# EAGLE design drutest2 (EAGLE 6.0)
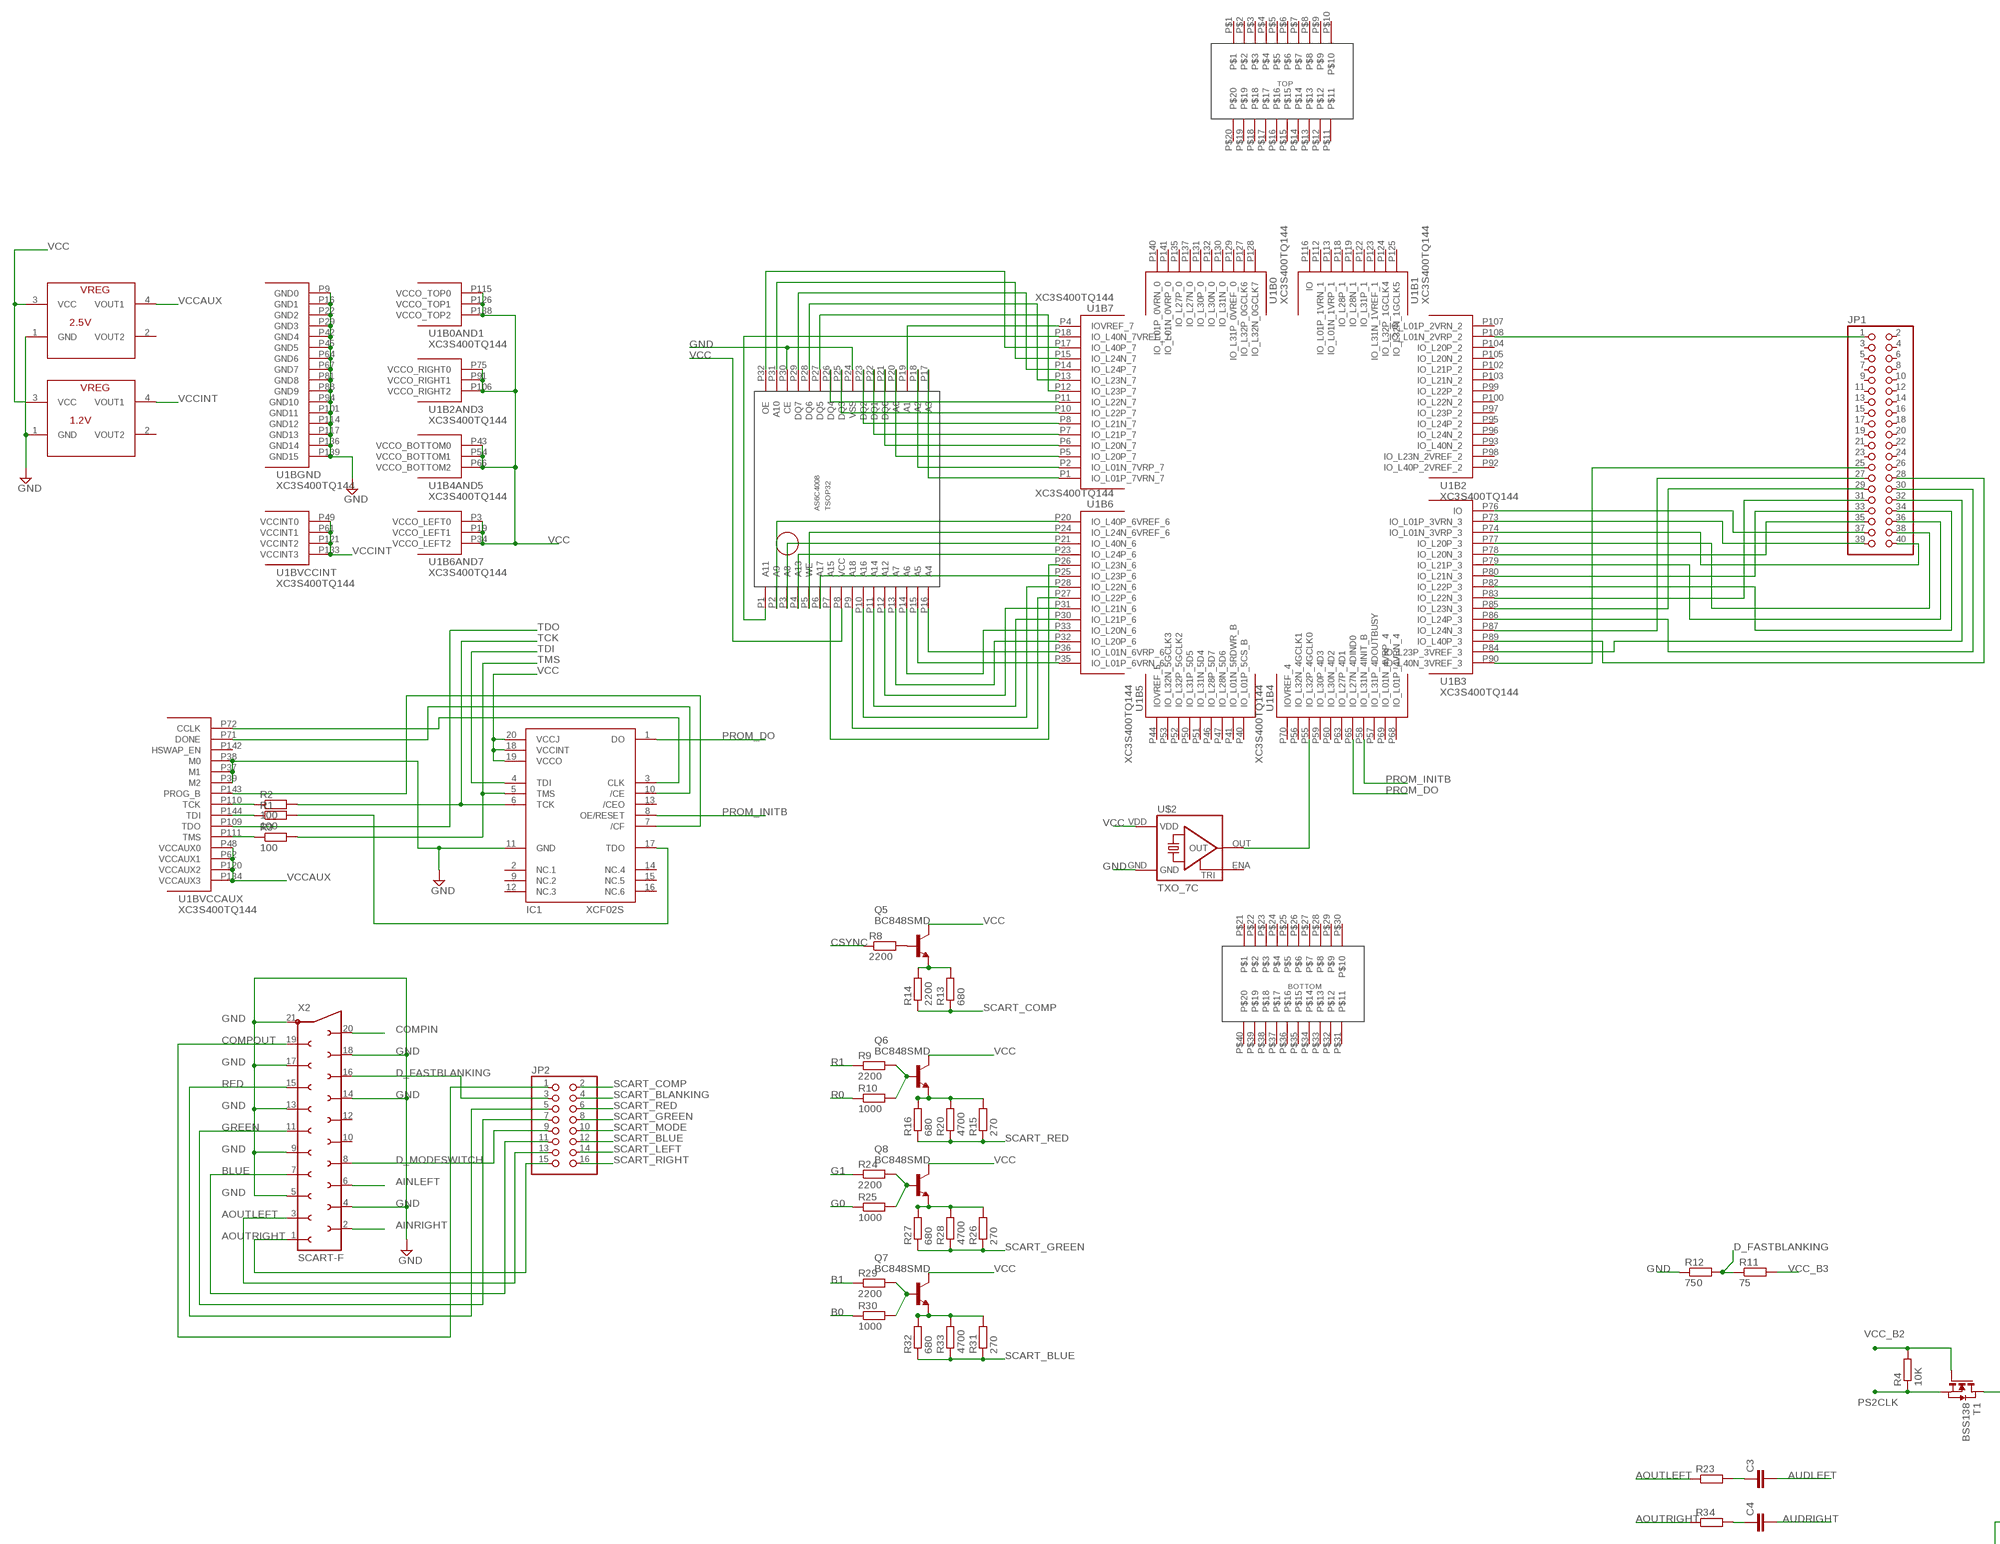
[diagram p0: schematic, sheet 1, part 1 of 2]
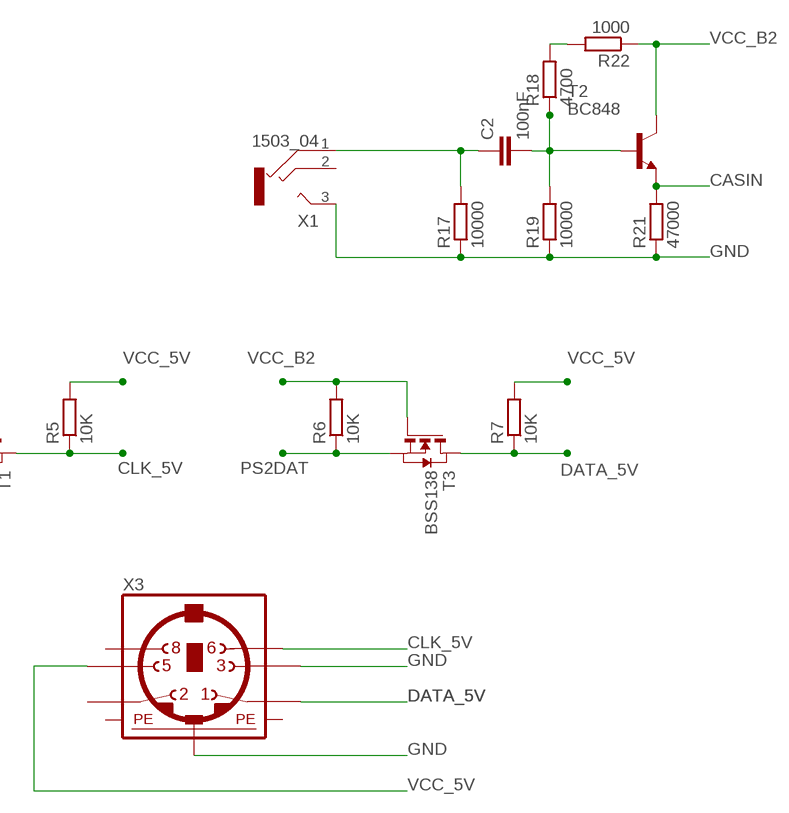
[diagram p1: schematic, sheet 1, part 2 of 2]

## Parts
C2  100nF  C-EUC0603  [C0603]
C3  C-EUC0603  [C0603]
C4  C-EUC0603  [C0603]
IC1  XCF02S  [VO20]
JP1  PINHD-2X20  [2X20]
JP2  PINHD-2X8  [2X08]
Q5  BC848SMD  [SOT23]
Q6  BC848SMD  [SOT23]
Q7  BC848SMD  [SOT23]
Q8  BC848SMD  [SOT23]
R1  100  R-EU_R0805  [R0805]
R2  100  R-EU_R0805  [R0805]
R3  100  R-EU_R0805  [R0805]
R4  10K  R-EU_R0805  [R0805]
R5  10K  R-EU_R0805  [R0805]
R6  10K  R-EU_R0805  [R0805]
R7  10K  R-EU_R0805  [R0805]
R8  2200  R-EU_R0805  [R0805]
R9  2200  R-EU_R0805  [R0805]
R10  1000  R-EU_R0805  [R0805]
R11  75  R-EU_R0805  [R0805]
R12  750  R-EU_R0805  [R0805]
R13  680  R-EU_R0805  [R0805]
R14  2200  R-EU_R0805  [R0805]
R15  270  R-EU_R0805  [R0805]
R16  680  R-EU_R0805  [R0805]
R17  10000  R-EU_R0805  [R0805]
R18  4700  R-EU_R0805  [R0805]
R19  10000  R-EU_R0805  [R0805]
R20  4700  R-EU_R0805  [R0805]
R21  47000  R-EU_R0805  [R0805]
R22  1000  R-EU_R0805  [R0805]
R23  R-EU_M0805  [M0805]
R24  2200  R-EU_R0805  [R0805]
R25  1000  R-EU_R0805  [R0805]
R26  270  R-EU_R0805  [R0805]
R27  680  R-EU_R0805  [R0805]
R28  4700  R-EU_R0805  [R0805]
R29  2200  R-EU_R0805  [R0805]
R30  1000  R-EU_R0805  [R0805]
R31  270  R-EU_R0805  [R0805]
R32  680  R-EU_R0805  [R0805]
R33  4700  R-EU_R0805  [R0805]
R34  R-EU_M0805  [M0805]
T1  BSS138  NMOSSOT23  [SOT-23]
T2  BC848  [SOT23]
T3  BSS138  NMOSSOT23  [SOT-23]
U1  XC3S400TQ144  [TQ144]
U$1  AS6C4008  [TSOP32]
U$2  TXO_7C  [OSC_7C]
U$3  2.5V  NX1117  [SOT223]
U$4  1.2V  NX1117  [SOT223]
U$5  EXPHDR  [EXPHDR]
X1  1503_04  [1503_04]
X2  SCART-F  [SCART-F]
X3  MINI_DIN_6  [M_DIN6]

## Nets
AINLEFT: X2.6
AINRIGHT: X2.2
AOUTLEFT: JP2.13 R23.1 X2.3
AOUTRIGHT: JP2.15 R34.1 X2.1
AUDLEFT: C3.2
AUDRIGHT: C4.2
B0: R30.1
B1: R29.1
BLUE: JP2.11 X2.7
CASIN: R21.2 T2.2(E)
CLK_5V: R5.1 T1.1(D) X3.6
COMPIN: X2.20
COMPOUT: JP2.1 X2.19
CSYNC: R8.1
D_FASTBLANKING: JP2.3 R11.1 R12.2 X2.16
D_MODESWITCH: JP2.9 X2.8
DATA_5V: R7.1 T3.1(D) X3.1
G0: R25.1
G1: R24.1
GND: IC1.11(GND) R12.1 R17.1 R19.1 R21.1 U1.P9(BGND:GND0) U1.P16(BGND:GND1) U1.P22(BGND:GND2) U1.P29(BGND:GND3) U1.P37(BVCCAUX:M1) U1.P38(BVCCAUX:M0) U1.P39(BVCCAUX:M2) U1.P42(BGND:GND4) U1.P45(BGND:GND5) U1.P64(BGND:GND6) U1.P67(BGND:GND7) U1.P81(BGND:GND8) U1.P88(BGND:GND9) U1.P94(BGND:GND10) U1.P101(BGND:GND11) U1.P114(BGND:GND12) U1.P117(BGND:GND13) U1.P136(BGND:GND14) U1.P139(BGND:GND15) U$1.P24(VSS) U$1.P30(CE) U$2.GND U$3.1(GND) U$4.1(GND) X1.3 X2.4 X2.5 X2.9 X2.13 X2.14 X2.17 X2.18 X2.21 X3.3 X3.SH2(PE2)
GREEN: JP2.7 X2.11
N$1: U1.P1(B7:IO_L01P_7VRN_7) U$1.P17(A3)
N$2: U1.P2(B7:IO_L01N_7VRP_7) U$1.P18(A2)
N$3: U1.P4(B7:IOVREF_7) U$1.P19(A1)
N$4: U1.P5(B7:IO_L20P_7) U$1.P20(A0)
N$5: U1.P6(B7:IO_L20N_7) U$1.P21(DQ0)
N$6: U1.P7(B7:IO_L21P_7) U$1.P22(DQ1)
N$7: U1.P8(B7:IO_L21N_7) U$1.P23(DQ2)
N$8: U1.P10(B7:IO_L22P_7) U$1.P25(DQ3)
N$9: U1.P11(B7:IO_L22N_7) U$1.P26(DQ4)
N$10: U1.P12(B7:IO_L23P_7) U$1.P27(DQ5)
N$11: U1.P13(B7:IO_L23N_7) U$1.P28(DQ6)
N$12: U1.P14(B7:IO_L24P_7) U$1.P29(DQ7)
N$13: U1.P15(B7:IO_L24N_7) U$1.P31(A10)
N$14: U1.P17(B7:IO_L40P_7) U$1.P32(OE)
N$15: U1.P18(B7:IO_L40N_7VREF_7) U$1.P1(A11)
N$16: U1.P20(B6:IO_L40P_6VREF_6) U$1.P2(A9)
N$17: U1.P21(B6:IO_L40N_6) U$1.P3(A8)
N$18: U1.P23(B6:IO_L24P_6) U$1.P4(A13)
N$19: U1.P24(B6:IO_L24N_6VREF_6) U$1.P5(WE)
N$20: U1.P25(B6:IO_L23P_6) U$1.P6(A17)
N$21: U1.P26(B6:IO_L23N_6) U$1.P7(A15)
N$22: U1.P27(B6:IO_L22P_6) U$1.P9(A18)
N$23: U1.P28(B6:IO_L22N_6) U$1.P10(A16)
N$24: U1.P30(B6:IO_L21P_6) U$1.P11(A14)
N$25: U1.P31(B6:IO_L21N_6) U$1.P12(A12)
N$26: U1.P32(B6:IO_L20P_6) U$1.P13(A7)
N$27: U1.P33(B6:IO_L20N_6) U$1.P14(A6)
N$28: U1.P35(B6:IO_L01P_6VRN_6) U$1.P15(A5)
N$29: U1.P36(B6:IO_L01N_6VRP_6) U$1.P16(A4)
N$30: JP1.1 U1.P108(B2:IO_L01N_2VRP_2)
N$31: JP1.39 U1.P73(B3:IO_L01P_3VRN_3)
N$32: JP1.40 U1.P74(B3:IO_L01N_3VRP_3)
N$33: JP1.37 U1.P76(B3:IO)
N$34: JP1.38 U1.P77(B3:IO_L20P_3)
N$35: IC1.3(CLK) U1.P72(BVCCAUX:CCLK)
N$36: IC1.17(TDO) R1.2
N$37: JP1.35 U1.P78(B3:IO_L20N_3)
N$38: IC1.10(/CE) U1.P71(BVCCAUX:DONE)
N$39: R2.1 U1.P110(BVCCAUX:TCK)
N$40: IC1.7(/CF) U1.P143(BVCCAUX:PROG_B)
N$41: JP1.36 U1.P79(B3:IO_L21P_3)
N$42: R1.1 U1.P144(BVCCAUX:TDI)
N$43: R3.1 U1.P111(BVCCAUX:TMS)
N$44: JP1.33 U1.P80(B3:IO_L21N_3)
N$45: JP1.34 U1.P82(B3:IO_L22P_3)
N$46: JP1.31 U1.P83(B3:IO_L22N_3)
N$47: JP1.32 U1.P84(B3:IO_L23P_3VREF_3)
N$48: JP1.29 U1.P85(B3:IO_L23N_3)
N$49: JP1.30 U1.P86(B3:IO_L24P_3)
N$50: JP1.27 U1.P87(B3:IO_L24N_3)
N$51: JP1.28 U1.P89(B3:IO_L40P_3)
N$52: JP1.25 U1.P90(B3:IO_L40N_3VREF_3)
N$53: Q6.1(B) R9.2 R10.2
N$54: Q6.2(E) R15.2 R16.2 R20.2
N$55: Q8.1(B) R24.2 R25.2
N$56: Q8.2(E) R26.2 R27.2 R28.2
N$57: Q7.1(B) R29.2 R30.2
N$58: Q7.2(E) R31.2 R32.2 R33.2
N$59: Q5.2(E) R13.2 R14.2
N$60: C2.2 R18.1 R19.2 T2.1(B)
N$61: C2.1 R17.2 X1.1
N$62: R18.2 R22.2
N$63: Q5.1(B) R8.2
N$64: C3.1 R23.2
N$65: C4.1 R34.2
N$66: U1.P55(B4:IO_L32P_4GCLK0) U$2.OUT
PROM_DO: IC1.1(DO) U1.P65(B4:IO_L27N_4DIND0)
PROM_INITB: IC1.8(OE/RESET) U1.P58(B4:IO_L31N_4INIT_B)
PS2CLK: R4.1 T1.2(S)
PS2DAT: R6.1 T3.2(S)
R0: R10.1
R1: R9.1
RED: JP2.5 X2.15
SCART_BLANKING: JP2.4
SCART_BLUE: JP2.12 R31.1 R32.1 R33.1
SCART_COMP: JP2.2 R13.1 R14.1
SCART_GREEN: JP2.8 R26.1 R27.1 R28.1
SCART_LEFT: JP2.14
SCART_MODE: JP2.10
SCART_RED: JP2.6 R15.1 R16.1 R20.1
SCART_RIGHT: JP2.16
TCK: IC1.6(TCK) R2.2
TDI: IC1.4(TDI)
TDO: U1.P109(BVCCAUX:TDO)
TMS: IC1.5(TMS) R3.2
VCC: IC1.18(VCCINT) IC1.19(VCCO) IC1.20(VCCJ) Q5.3(C) Q6.3(C) Q7.3(C) Q8.3(C) U1.P3(B6AND7:VCCO_LEFT0) U1.P19(B6AND7:VCCO_LEFT1) U1.P34(B6AND7:VCCO_LEFT2) U1.P43(B4AND5:VCCO_BOTTOM0) U1.P54(B4AND5:VCCO_BOTTOM1) U1.P66(B4AND5:VCCO_BOTTOM2) U1.P75(B2AND3:VCCO_RIGHT0) U1.P91(B2AND3:VCCO_RIGHT1) U1.P106(B2AND3:VCCO_RIGHT2) U1.P115(B0AND1:VCCO_TOP0) U1.P126(B0AND1:VCCO_TOP1) U1.P138(B0AND1:VCCO_TOP2) U$1.P8(VCC) U$2.VDD U$3.3(VCC) U$4.3(VCC)
VCC_5V [power]: R5.2 R7.2 X3.5
VCC_B2: R4.2 R6.2 R22.1 T1.3(G) T2.3(C) T3.3(G)
VCC_B3: R11.2
VCCAUX: U1.P48(BVCCAUX:VCCAUX0) U1.P62(BVCCAUX:VCCAUX1) U1.P120(BVCCAUX:VCCAUX2) U1.P134(BVCCAUX:VCCAUX3) U$3.4(VOUT1)
VCCINT: U1.P49(BVCCINT:VCCINT0) U1.P61(BVCCINT:VCCINT1) U1.P121(BVCCINT:VCCINT2) U1.P133(BVCCINT:VCCINT3) U$4.4(VOUT1)
Unconnected: IC1.2(NC.1) IC1.9(NC.2) IC1.12(NC.3) IC1.13(/CEO) IC1.14(NC.4) IC1.15(NC.5) IC1.16(NC.6) JP1.2 JP1.3 JP1.4 JP1.5 JP1.6 JP1.7 JP1.8 JP1.9 JP1.10 JP1.11 JP1.12 JP1.13 JP1.14 JP1.15 JP1.16 JP1.17 JP1.18 JP1.19 JP1.20 JP1.21 JP1.22 JP1.23 JP1.24 JP1.26 U1.P40(B5:IO_L01P_5CS_B) U1.P41(B5:IO_L01N_5RDWR_B) U1.P44(B5:IOVREF_5) U1.P46(B5:IO_L28P_5D7) U1.P47(B5:IO_L28N_5D6) U1.P50(B5:IO_L31P_5D5) U1.P51(B5:IO_L31N_5D4) U1.P52(B5:IO_L32P_5GCLK2) U1.P53(B5:IO_L32N_5GCLK3) U1.P56(B4:IO_L32N_4GCLK1) U1.P57(B4:IO_L31P_4DOUTBUSY) U1.P59(B4:IO_L30P_4D3) U1.P60(B4:IO_L30N_4D2) U1.P63(B4:IO_L27P_4D1) U1.P68(B4:IO_L01P_4VRN_4) U1.P69(B4:IO_L01N_4VRP_4) U1.P70(B4:IOVREF_4) U1.P92(B2:IO_L40P_2VREF_2) U1.P93(B2:IO_L40N_2) U1.P95(B2:IO_L24P_2) U1.P96(B2:IO_L24N_2) U1.P97(B2:IO_L23P_2) U1.P98(B2:IO_L23N_2VREF_2) U1.P99(B2:IO_L22P_2) U1.P100(B2:IO_L22N_2) U1.P102(B2:IO_L21P_2) U1.P103(B2:IO_L21N_2) U1.P104(B2:IO_L20P_2) U1.P105(B2:IO_L20N_2) U1.P107(B2:IO_L01P_2VRN_2) U1.P112(B1:IO_L01P_1VRN_1) U1.P113(B1:IO_L01N_1VRP_1) U1.P116(B1:IO) U1.P118(B1:IO_L28P_1) U1.P119(B1:IO_L28N_1) U1.P122(B1:IO_L31P_1) U1.P123(B1:IO_L31N_1VREF_1) U1.P124(B1:IO_L32P_1GCLK4) U1.P125(B1:IO_L32N_1GCLK5) U1.P127(B0:IO_L32P_0GCLK6) U1.P128(B0:IO_L32N_0GCLK7) U1.P129(B0:IO_L31P_0VREF_0) U1.P130(B0:IO_L31N_0) U1.P131(B0:IO_L30P_0) U1.P132(B0:IO_L30N_0) U1.P135(B0:IO_L27P_0) U1.P137(B0:IO_L27N_0) U1.P140(B0:IO_L01P_0VRN_0) U1.P141(B0:IO_L01N_0VRP_0) U1.P142(BVCCAUX:HSWAP_EN) U$2.ENA(TRI) U$3.2(VOUT2) U$4.2(VOUT2) U$5.P$1 U$5.P$2 U$5.P$3 U$5.P$4 U$5.P$5 U$5.P$6 U$5.P$7 U$5.P$8 U$5.P$9 U$5.P$10 U$5.P$11 U$5.P$12 U$5.P$13 U$5.P$14 U$5.P$15 U$5.P$16 U$5.P$17 U$5.P$18 U$5.P$19 U$5.P$20 U$5.P$21 U$5.P$22 U$5.P$23 U$5.P$24 U$5.P$25 U$5.P$26 U$5.P$27 U$5.P$28 U$5.P$29 U$5.P$30 U$5.P$31 U$5.P$32 U$5.P$33 U$5.P$34 U$5.P$35 U$5.P$36 U$5.P$37 U$5.P$38 U$5.P$39 U$5.P$40 X1.2 X2.10 X2.12 X3.2 X3.8

## Power pins joined to a net without a drawn wire
PE1: X3.SH1(PE1)
PE3: X3.SH3(PE3)

## Library data of the parts
C2-C4 = resistor:C-EU: CAPACITOR, European symbol
IC1 = smd-special:XCF02S
JP1 = pinhead:PINHD-2X20: PIN HEADER
JP2 = pinhead:PINHD-2X8: PIN HEADER
Q5-Q8 = bc548:BC848*: NPN Transistor
R1-R22 R24-R33 = rcl:R-EU_: RESISTOR, European symbol
R23 R34 = resistor:R-EU_: RESISTOR, European symbol
T1 T3 = zetex:NMOSSOT23: MOS FET; OC_FARNELL: unknown; OC_NEWARK: unknown
T2 = transistor:BC848: NPN TRANSISTOR
U1 = xilinx_spartan3_virtex4_and_5:XC3S400TQ144: Xilinx FPGA
U$1 = cpcfpga:AS6C4008
U$2 = cpcfpga:TXO_7C: TXC crystal oscillator http://www.txccrystal.com/images/pdf/7c.pdf
U$3 U$4 = cpcfpga:NX1117
U$5 = cpcfpga:EXPHDR
X1 = con-lumberg:1503_04: Jack connectors according to JISC 6560, 3.5 mm, IP 57 Klinkensteckverbinder nach JISC 6560, 3,5 mm, IP 57 Source: http://www.lumberg.com/Produkte/PDFs/1503_04.pdf; OC_FARNELL: 1216981; OC_NEWARK: unknown
X2 = con-hirschmann:SCART-F: TV SCART CONNECTOR; OC_FARNELL: unknown; OC_NEWARK: unknown
X3 = mini_din:MINI_DIN_6

## Net classes
1 power: width 0.6 mm, drill 1.1 mm, clearance 0.4 mm

## Board
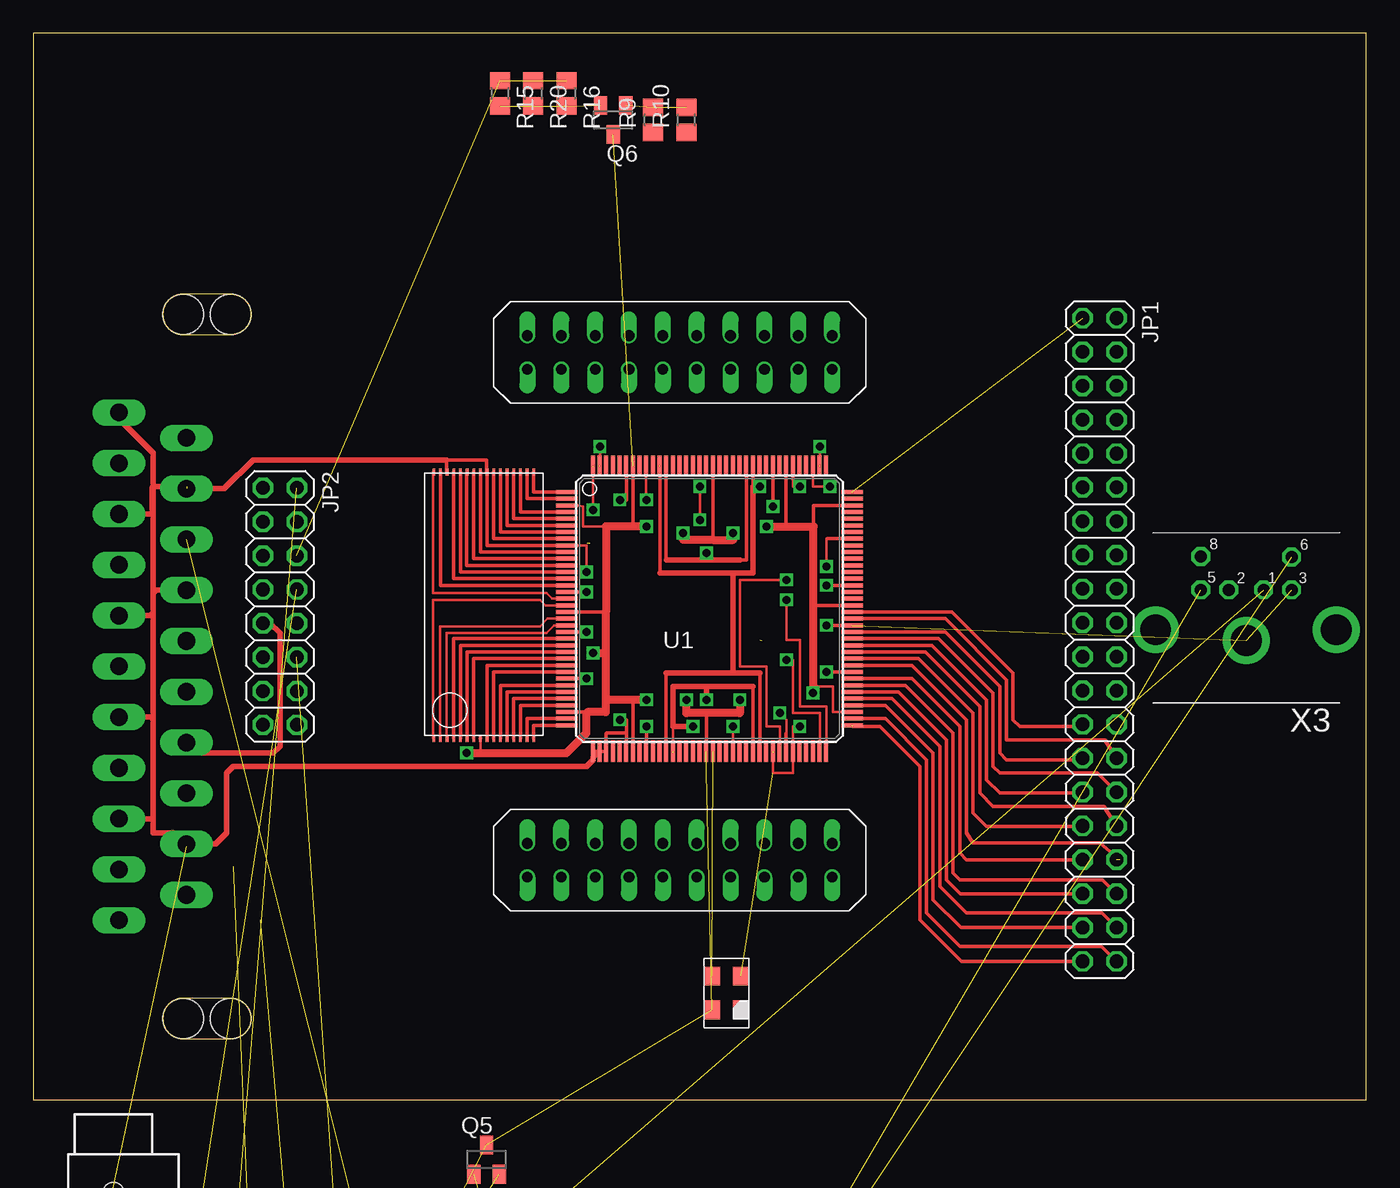
[diagram p2: board, top side]
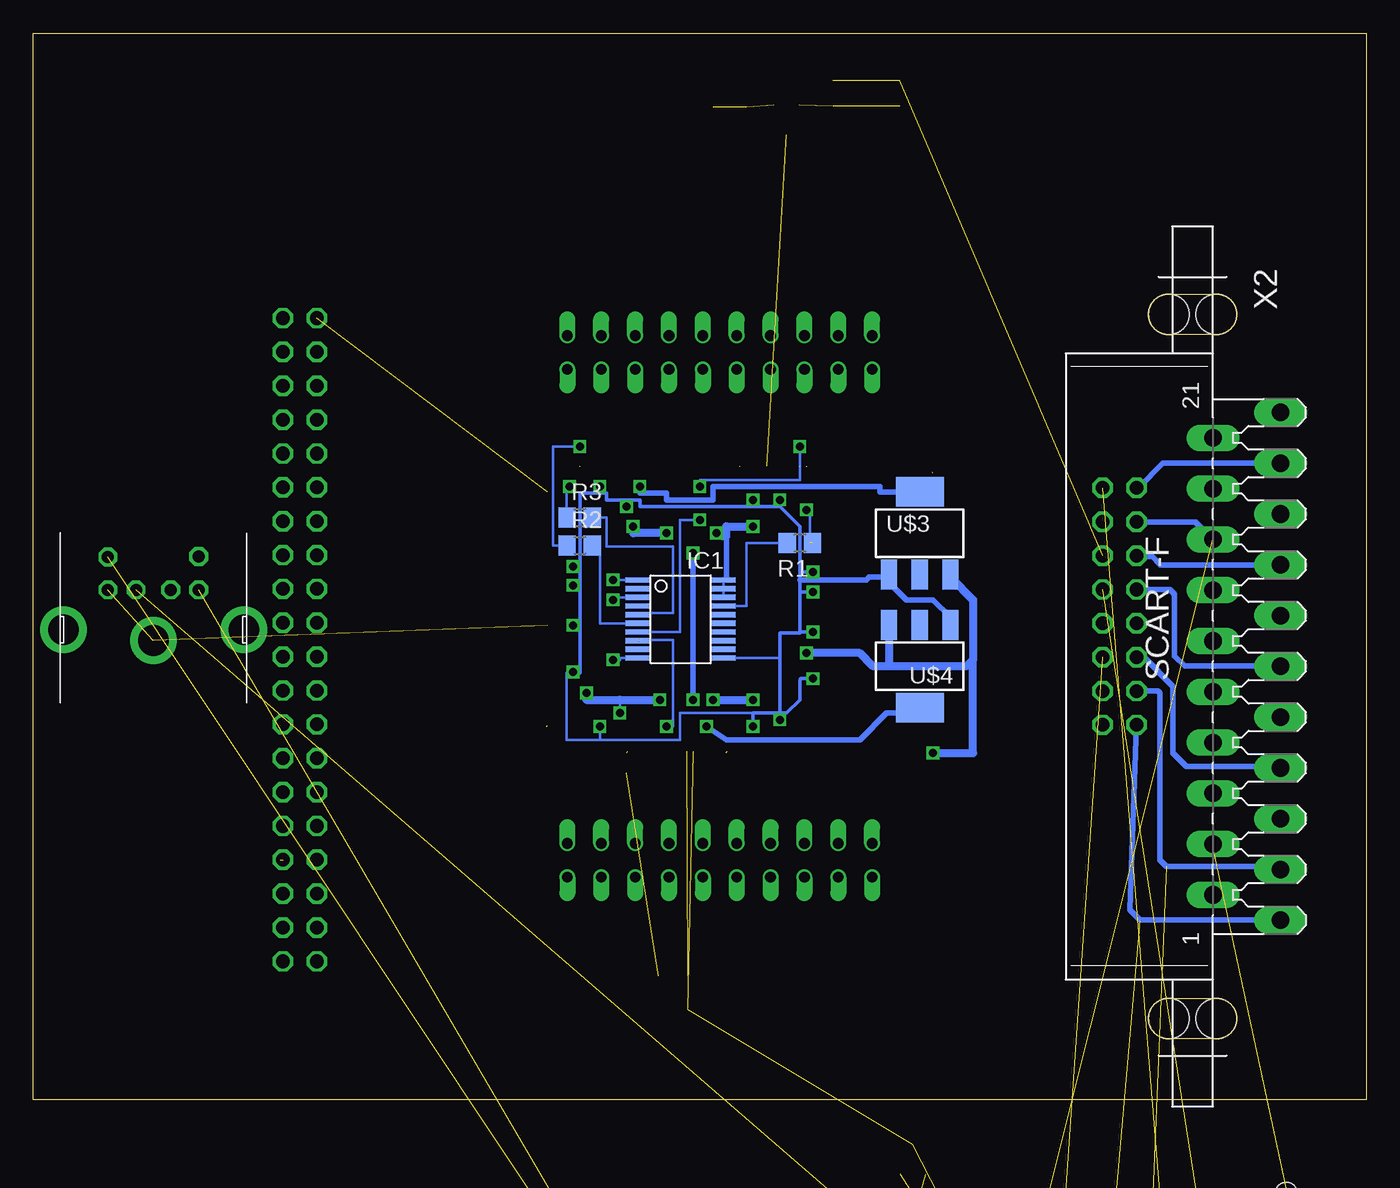
[diagram p3: board, bottom side, seen from below]

Size 100 x 80 mm. Coordinates in mm from the lower left corner, seen from the top.
Outline: 0,0 100,0 100,80 0,80 0,0
Copper layers (1*16): Top 0.0356mm / dielectric 1.5011mm / Bottom 0.0356mm
Design rules: minimum track width 6mil, minimum drill 13mil, track to track 6mil, track to pad 6mil, pad to pad 6mil, via to via 6mil, smd to smd 6mil, copper to edge 15mil, drill to drill 6mil, minimum pad ring 7mil, minimum via ring 7mil, stop-mask expansion 4mil, vias tented up to drill 0mil, thermal gap 10mil

### Footprints (pad centres in the part's own frame; a part is rotated, then mirrored left to right if it is on the bottom)
C0603 = smd 1.1 x 1: 1 -0.85,0; 2 0.85,0
VO20 = smd 0.4 x 1.8: 1 5.85,6.15; 2 5.2,6.15; 3 4.55,6.15; 4 3.9,6.15; 5 3.25,6.15; 6 2.6,6.15; 7 1.95,6.15; 8 1.3,6.15; 9 0.65,6.15; 10 0,6.15; 11 0,-0.3; 12 0.65,-0.3; 13 1.3,-0.3; 14 1.95,-0.3; 15 2.6,-0.3; 16 3.25,-0.3; 17 3.9,-0.3; 18 4.55,-0.3; 19 5.2,-0.3; 20 5.85,-0.3
2X20 = drill 1.016 octagon: 1 -24.13,-1.27; 2 -24.13,1.27; 3 -21.59,-1.27; 4 -21.59,1.27; 5 -19.05,-1.27; 6 -19.05,1.27; 7 -16.51,-1.27; 8 -16.51,1.27; 9 -13.97,-1.27; 10 -13.97,1.27; 11 -11.43,-1.27; 12 -11.43,1.27; 13 -8.89,-1.27; 14 -8.89,1.27; 15 -6.35,-1.27; 16 -6.35,1.27; 17 -3.81,-1.27; 18 -3.81,1.27; 19 -1.27,-1.27; 20 -1.27,1.27; 21 1.27,-1.27; 22 1.27,1.27; 23 3.81,-1.27; 24 3.81,1.27; 25 6.35,-1.27; 26 6.35,1.27; 27 8.89,-1.27; 28 8.89,1.27; 29 11.43,-1.27; 30 11.43,1.27; 31 13.97,-1.27; 32 13.97,1.27; 33 16.51,-1.27; 34 16.51,1.27; 35 19.05,-1.27; 36 19.05,1.27; 37 21.59,-1.27; 38 21.59,1.27; 39 24.13,-1.27; 40 24.13,1.27
2X08 = drill 1.016 octagon: 1 -8.89,-1.27; 2 -8.89,1.27; 3 -6.35,-1.27; 4 -6.35,1.27; 5 -3.81,-1.27; 6 -3.81,1.27; 7 -1.27,-1.27; 8 -1.27,1.27; 9 1.27,-1.27; 10 1.27,1.27; 11 3.81,-1.27; 12 3.81,1.27; 13 6.35,-1.27; 14 6.35,1.27; 15 8.89,-1.27; 16 8.89,1.27
SOT23 = smd 1 x 1.4: 1 -0.95,-1.1; 2 0.95,-1.1; 3 0,1.1
R0805 = smd 1.3 x 1.5: 1 -0.95,0; 2 0.95,0
M0805 = smd 1.3 x 1.6: 1 -0.95,0; 2 0.95,0
SOT-23 = smd 0.787 x 0.889: 1 0.025,-1.016; 2 -0.94,1.016; 3 0.991,1.016
TQ144 = smd 1.6 x 0.3: P1 -10.7,8.75; P2 -10.7,8.25; P3 -10.7,7.75; P4 -10.7,7.25; P5 -10.7,6.75; P6 -10.7,6.25; P7 -10.7,5.75; P8 -10.7,5.25; P9 -10.7,4.75; P10 -10.7,4.25; P11 -10.7,3.75; P12 -10.7,3.25; P13 -10.7,2.75; P14 -10.7,2.25; P15 -10.7,1.75; P16 -10.7,1.25; P17 -10.7,0.75; P18 -10.7,0.25; P19 -10.7,-0.25; P20 -10.7,-0.75; P21 -10.7,-1.25; P22 -10.7,-1.75; P23 -10.7,-2.25; P24 -10.7,-2.75; P25 -10.7,-3.25; P26 -10.7,-3.75; P27 -10.7,-4.25; P28 -10.7,-4.75; P29 -10.7,-5.25; P30 -10.7,-5.75; P31 -10.7,-6.25; P32 -10.7,-6.75; P33 -10.7,-7.25; P34 -10.7,-7.75; P35 -10.7,-8.25; P36 -10.7,-8.75; P73 10.7,-8.75; P74 10.7,-8.25; P75 10.7,-7.75; P76 10.7,-7.25; P77 10.7,-6.75; P78 10.7,-6.25; P79 10.7,-5.75; P80 10.7,-5.25; P81 10.7,-4.75; P82 10.7,-4.25; P83 10.7,-3.75; P84 10.7,-3.25; P85 10.7,-2.75; P86 10.7,-2.25; P87 10.7,-1.75; P88 10.7,-1.25; P89 10.7,-0.75; P90 10.7,-0.25; P91 10.7,0.25; P92 10.7,0.75; P93 10.7,1.25; P94 10.7,1.75; P95 10.7,2.25; P96 10.7,2.75; P97 10.7,3.25; P98 10.7,3.75; P99 10.7,4.25; P100 10.7,4.75; P101 10.7,5.25; P102 10.7,5.75; P103 10.7,6.25; P104 10.7,6.75; P105 10.7,7.25; P106 10.7,7.75; P107 10.7,8.25; P108 10.7,8.75 | smd 0.3 x 1.6: P37 -8.75,-10.7; P38 -8.25,-10.7; P39 -7.75,-10.7; P40 -7.25,-10.7; P41 -6.75,-10.7; P42 -6.25,-10.7; P43 -5.75,-10.7; P44 -5.25,-10.7; P45 -4.75,-10.7; P46 -4.25,-10.7; P47 -3.75,-10.7; P48 -3.25,-10.7; P49 -2.75,-10.7; P50 -2.25,-10.7; P51 -1.75,-10.7; P52 -1.25,-10.7; P53 -0.75,-10.7; P54 -0.25,-10.7; P55 0.25,-10.7; P56 0.75,-10.7; P57 1.25,-10.7; P58 1.75,-10.7; P59 2.25,-10.7; P60 2.75,-10.7; P61 3.25,-10.7; P62 3.75,-10.7; P63 4.25,-10.7; P64 4.75,-10.7; P65 5.25,-10.7; P66 5.75,-10.7; P67 6.25,-10.7; P68 6.75,-10.7; P69 7.25,-10.7; P70 7.75,-10.7; P71 8.25,-10.7; P72 8.75,-10.7; P109 8.75,10.7; P110 8.25,10.7; P111 7.75,10.7; P112 7.25,10.7; P113 6.75,10.7; P114 6.25,10.7; P115 5.75,10.7; P116 5.25,10.7; P117 4.75,10.7; P118 4.25,10.7; P119 3.75,10.7; P120 3.25,10.7; P121 2.75,10.7; P122 2.25,10.7; P123 1.75,10.7; P124 1.25,10.7; P125 0.75,10.7; P126 0.25,10.7; P127 -0.25,10.7; P128 -0.75,10.7; P129 -1.25,10.7; P130 -1.75,10.7; P131 -2.25,10.7; P132 -2.75,10.7; P133 -3.25,10.7; P134 -3.75,10.7; P135 -4.25,10.7; P136 -4.75,10.7; P137 -5.25,10.7; P138 -5.75,10.7; P139 -6.25,10.7; P140 -6.75,10.7; P141 -7.25,10.7; P142 -7.75,10.7; P143 -8.25,10.7; P144 -8.75,10.7
TSOP32 = smd 0.5 x 0.2: P1 -9.75,3.75; P2 -9.75,3.25; P3 -9.75,2.75; P4 -9.75,2.25; P5 -9.75,1.75; P6 -9.75,1.25; P7 -9.75,0.75; P8 -9.75,0.25; P9 -9.75,-0.25; P10 -9.75,-0.75; P11 -9.75,-1.25; P12 -9.75,-1.75; P13 -9.75,-2.25; P14 -9.75,-2.75; P15 -9.75,-3.25; P16 -9.75,-3.75; P17 10.25,-3.75; P18 10.25,-3.25; P19 10.25,-2.75; P20 10.25,-2.25; P21 10.25,-1.75; P22 10.25,-1.25; P23 10.25,-0.75; P24 10.25,-0.25; P25 10.25,0.25; P26 10.25,0.75; P27 10.25,1.25; P28 10.25,1.75; P29 10.25,2.25; P30 10.25,2.75; P31 10.25,3.25; P32 10.25,3.75
OSC_7C = smd 1.4 x 1.2: ENA -1.27,-1.1; GND 1.27,-1.1; OUT 1.27,1.1; VDD -1.27,1.1
SOT223 = smd 1.219 x 2.235: 1 -2.311,-3.099; 2 0,-3.099; 3 2.311,-3.099 | smd 3.6 x 2.2: 4 0,3.099
EXPHDR = drill 0.8 offset: P$1 -11.43,-17.78; P$2 -8.89,-17.78; P$3 -6.35,-17.78; P$4 -3.81,-17.78; P$5 -1.27,-17.78; P$6 -11.43,20.32; P$7 -8.89,20.32; P$8 -6.35,20.32; P$9 -3.81,20.32; P$10 -1.27,20.32; P$11 1.27,20.32; P$12 3.81,20.32; P$13 6.35,20.32; P$14 8.89,20.32; P$15 11.43,20.32; P$16 1.27,-17.78; P$17 3.81,-17.78; P$18 6.35,-17.78; P$19 8.89,-17.78; P$20 11.43,-17.78; P$21 -11.43,-20.32; P$22 -8.89,-20.32; P$23 -6.35,-20.32; P$24 -3.81,-20.32; P$25 -1.27,-20.32; P$26 -11.43,17.78; P$27 -8.89,17.78; P$28 -6.35,17.78; P$29 -3.81,17.78; P$30 -1.27,17.78; P$31 1.27,17.78; P$32 3.81,17.78; P$33 6.35,17.78; P$34 8.89,17.78; P$35 11.43,17.78; P$36 1.27,-20.32; P$37 3.81,-20.32; P$38 6.35,-20.32; P$39 8.89,-20.32; P$40 11.43,-20.32
1503_04 = drill 0.8 pad 1.2 long: 1 3.9,-10.25; 2 0.65,-10.25 | drill 1 pad 1.2 long: 3 -2.3,-10.25 | hole 1.6: 0,0
SCART-F = drill 1.321 long: 1 19.05,5.08; 2 17.145,0; 3 15.24,5.08; 4 13.335,0; 5 11.43,5.08; 6 9.525,0; 7 7.62,5.08; 8 5.715,0; 9 3.81,5.08; 10 1.905,0; 11 0,5.08; 12 -1.905,0; 13 -3.81,5.08; 14 -5.715,0; 15 -7.62,5.08; 16 -9.525,0; 17 -11.43,5.08; 18 -13.335,0; 19 -15.24,5.08; 20 -17.145,0; 21 -19.05,5.08 | hole 3.023: 26.416,0.254; 26.416,-3.302; -26.416,0.254; -26.416,-3.302
M_DIN6 = drill 0.9 pad 1.422 octagon: 1 -1.3,-3.75; 2 1.3,-3.75; 3 -3.4,-3.75; 5 3.4,-3.75; 6 -3.4,-6.2; 8 3.4,-6.25 | drill 2.3 pad 3.5: SH1 6.8,-0.75; SH2 0,0.05; SH3 -6.75,-0.75

### Placement (x,y rotation side)
C2  12,-56 0 top  (outside the outline)
C3  28.5,-56 0 top  (outside the outline)
C4  32,-56 0 top  (outside the outline)
IC1  48.52,33.13 90 bottom
JP1  80,34.5 270 top
JP2  18.5,37 270 top
Q5  34,-4.5 0 top  (outside the outline)
Q6  43.5,73.5 180 top
Q7  13.5,-23 0 top  (outside the outline)
Q8  24.5,-23 0 top  (outside the outline)
R1  42.49,41.75 180 bottom
R2  59,41.58 0 bottom
R3  59.01,43.68 0 bottom
R4  29.5,-50 0 top  (outside the outline)
R5  35,-50 0 top  (outside the outline)
R6  40.5,-50 0 top  (outside the outline)
R7  2,-56.5 0 top  (outside the outline)
R8  39,-30 0 top  (outside the outline)
R9  46.5,73.5 90 top
R10  49,73.5 90 top
R11  7.5,-56.5 0 top  (outside the outline)
R12  32,-43.5 0 top  (outside the outline)
R13  37.5,-43.5 0 top  (outside the outline)
R14  14,-37 0 top  (outside the outline)
R15  35,75.5 270 top
R16  40,75.5 270 top
R17  18,-30 0 top  (outside the outline)
R18  20,-37 0 top  (outside the outline)
R19  25,-30 0 top  (outside the outline)
R20  37.5,75.5 270 top
R21  32,-30 0 top  (outside the outline)
R22  32,-37 0 top  (outside the outline)
R23  19,-56 0 top  (outside the outline)
R24  38,-37 0 top  (outside the outline)
R25  2,-43.5 0 top  (outside the outline)
R26  7.5,-50 0 top  (outside the outline)
R27  13,-50 0 top  (outside the outline)
R28  8,-43.5 0 top  (outside the outline)
R29  14,-43.5 0 top  (outside the outline)
R30  20,-43.5 0 top  (outside the outline)
R31  18.5,-50 0 top  (outside the outline)
R32  24,-50 0 top  (outside the outline)
R33  26,-43.5 0 top  (outside the outline)
R34  24,-56 0 top  (outside the outline)
T1  2,-32 0 top  (outside the outline)
T2  35.5,-23 0 top  (outside the outline)
T3  10,-32 0 top  (outside the outline)
U1  50.73,36.83 0 top
U$1  33.79,36.83 90 top
U$2  52,8 90 top
U$3  33.5,42.5 0 bottom
U$4  33.5,32.5 180 bottom
U$5  48.5,37 0 top
X1  6,-7 0 top  (outside the outline)
X2  11.5,32.5 270 bottom
X3  91,34.5 180 top

### Tracks (layer width: path | path; a pad name or v marks a point on that pad's centre or on a via)
AOUTLEFT  (1 unrouted)
  Bottom 0.406: JP2.13 15.65,30.65 15.5,30.5 15.5,18 15,17.5 6.66,17.5 X2.3
AOUTRIGHT  (1 unrouted)
  Bottom 0.406: JP2.15 17.73,14.23 17,13.5 6.97,13.5 X2.1
BLUE
  Bottom 0.406: JP2.11 16.69,33.19 14.5,31 14.5,26 13.5,25 6.54,25 X2.7
CASIN  (1 unrouted)
CLK_5V  (2 unrouted)
COMPOUT
  Bottom 0.406: JP2.1 17.11,45.89 15.26,47.74 X2.19
D_FASTBLANKING  (2 unrouted)
  Bottom 0.406: JP2.3 12.82,43.35 X2.16
D_MODESWITCH
  Top 0.406: JP2.9 17.77,35.73 18.5,35 18.5,26.5 18,26 12.29,26 X2.8
DATA_5V  (2 unrouted)
GND  (via drill 0.6)  (10 unrouted)
  Top 0.2: 56.98,26.48 57,26.48 57,24.5 55.5,24.5 55.5,26 | U1.P9 41.5,41.58 v41.5,39.58 | v57.5,28 56.98,28 U1.P67 | 59.58,42.08 59.5,42.08 v59.5,40 | 56.98,46.52 57,46.52 57,46 v57.5,46 | U1.P136 45.98,45.02 v46,45
  Top 0.254: U1.P9 34.04,41.58 U$1.P24 34,47.08 34,48 31,48 31,47.08 U$1.P30 | U1.P139 44.5,47.53 44.5,45 v44,45 | U1.P16 v41.5,38.08 | 41.56,39.58 v41.5,39.58 | U1.P22 v41.5,35.08 | U1.P29 v41.5,31.58 | U1.P94 v59.5,38.58 | U1.P81 v59.5,32.08 | U1.P88 v59.5,35.58 | U1.P45 46,26.13 v46,28 | U1.P42 44.5,26.13 44.5,27.5 | 44.5,27.5 44.5,28.5 v44,28.5 | U1.P37 U1.P38 U1.P39 42.98,27.48 43,27.5 44.5,27.5 | U1.P114 56.98,46.52 | U1.P117 55.48,46.52 v55.5,44.5 | U1.P101 59.58,42.08 | U1.P67 56.98,26.48
  Top 0.406: X2.18 14.34,45.84 16.5,48 31,48 | X2.4 13.66,19.16 14.5,20 14.5,24.5 15,25 41.5,25 42,25.5 42,25.66 U1.P38 | X2.21 6.42,51.08 9,48.5 9,46 | 9,46 9,44 | 9,44 9,38 | 9,38 9,36.5 | 9,36.5 9,28.5 | 9,28.5 9,21 | 9,21 9,20 10.5,20 11.5,19 | 9,44 8.93,43.93 8.93,44 | X2.14 9.21,38.22 9,38 | X2.13 8.81,36.31 9,36.5 | X2.9 8.81,28.69 9,28.5 | 8.93,44 8.93,45.93 9,46 | 9,46 11.5,46 | X2.17 8.86,43.93 8.93,44 | X2.5 8.93,21.07 9,21
  Bottom 0.2: 46,29 51.5,29 51.5,27 57.5,27 | 42.42,31.58 42.5,31.58 42.5,31.5 | v59.5,40 59,40 | v55.5,44.5 55.5,45 | 57.5,27 60,27 60,32 59,32 | 57.5,27 v57.5,28 | IC1.11 44,33.13 44,33
  Bottom 0.254: v41.5,39.58 42.49,39.58 | 42.49,39.58 42.5,41.5 42.5,39 42.5,38 | v41.5,38.08 42.42,38.08 42.5,38 | v41.5,35.08 42.42,35.08 42.5,35 | 42.5,35 42.5,38 | v41.5,31.58 42.42,31.58 | 42.5,31.5 42.5,30 43.5,29 44,29 | 44,29 44,33 44,35 42.5,35 | v44,28.5 44,29 | v46,28 46,29 44,29 | 42.49,39.58 42.5,41.66 42.5,43 44,44.5 | 44,44.5 v44,45 | v46,45 46,44.5 | 46,44.5 44,44.5 | v57.5,46 57.5,45.5 | 57.5,45.5 57,45.5 57,45 55.5,45 54.5,45 54.5,44.5 46,44.5 | 57.5,45.5 59,45.5 59,40 59,38.5 | 59,35.5 59,32 59.08,32.08 v59.5,32.08 | v59.5,38.58 59.08,38.58 59,38.5 | v59.5,35.58 59.08,35.58 59,35.5 | 59,35.5 59,38.5
  Bottom 0.4: 42.5,39 37.5,39 37.31,39.19 35.81,39.19 U$3.1 35.5,39.09 35.5,38.5 34.5,37.5 32.5,37.5 31.19,36.19 U$4.1
GREEN
  Bottom 0.406: JP2.7 14.72,38.27 14.39,37.94 14.39,33.29 13.62,32.52 6.45,32.52 X2.11
N$1
  Top 0.254: U1.P1 37.54,45.58 U$1.P17
N$2
  Top 0.254: U1.P2 37.04,45.08 U$1.P18
N$3
  Top 0.254: U1.P4 36.54,44.08 U$1.P19
N$4
  Top 0.254: U1.P5 36.04,43.58 U$1.P20
N$5
  Top 0.254: U1.P6 35.54,43.08 U$1.P21
N$6
  Top 0.254: U1.P7 35.04,42.58 U$1.P22
N$7
  Top 0.254: U1.P8 34.54,42.08 U$1.P23
N$8
  Top 0.254: U1.P10 33.54,41.08 U$1.P25
N$9
  Top 0.254: U1.P11 33.04,40.58 U$1.P26
N$10  (1 unrouted)
  Top 0.254: U1.P12 32.5,40.08 32.5,47
N$11
  Top 0.254: U1.P13 32.04,39.58 U$1.P28
N$12
  Top 0.254: U1.P14 31.54,39.08 U$1.P29
N$13
  Top 0.254: U1.P15 30.54,38.58 U$1.P31
N$14
  Top 0.2: U1.P17 38.92,37.58 38.5,38 30,38 30,47.08 U$1.P32
N$15
  Top 0.2: U1.P18 38.42,37.08 38,37.5 30,37.5 30,27.08 U$1.P1
N$16
  Top 0.2: U1.P20 38.58,36.08 38,35.5 30.5,35.5 30.5,27.08 U$1.P2
N$17
  Top 0.2: U$1.P3 31,27.08 31,35 38.5,35 39.08,35.58 U1.P21
N$18
  Top 0.254: U1.P23 31.54,34.58 U$1.P4
N$19
  Top 0.254: U1.P24 32.04,34.08 U$1.P5
N$20
  Top 0.254: U1.P25 32.54,33.58 U$1.P6
N$21
  Top 0.254: U1.P26 33.04,33.08 U$1.P7
N$22
  Top 0.254: U1.P27 34.04,32.58 U$1.P9
N$23
  Top 0.254: U1.P28 34.54,32.08 U$1.P10
N$24
  Top 0.254: U1.P30 35.04,31.08 U$1.P11
N$25
  Top 0.254: U1.P31 35.54,30.58 U$1.P12
N$26
  Top 0.254: U1.P32 36.04,30.08 U$1.P13
N$27
  Top 0.254: U1.P33 36.54,29.58 U$1.P14
N$28
  Top 0.254: U1.P35 37.04,28.58 U$1.P15
N$29
  Top 0.254: U1.P36 37.54,28.08 U$1.P16
N$30  (1 unrouted)
N$31  (1 unrouted)
  Top 0.254: JP1.39 69.63,10.37 66.5,13.5 66.5,25 63.5,28 61.5,28
N$32
  Top 0.254: U1.P74 63.92,28.58 67,25.5 67,14 69.5,11.5 80.14,11.5 JP1.40
N$33
  Top 0.254: JP1.37 69.59,12.91 67.5,15 67.5,26 63.92,29.58 U1.P76
N$34
  Top 0.254: U1.P77 64.42,30.08 68,26.5 68,16 70,14 80.18,14 JP1.38
N$35  (via drill 0.6)
  Top 0.2: U1.P72 59.5,26.13 59.5,29.5 57.5,29.5 57.5,34.5 56.5,34.5 v56.5,37.5
  Bottom 0.2: IC1.3 56.5,37.68 v56.5,37.5
N$36
  Bottom 0.2: IC1.17 46.5,37.03 46.5,41.75 R1.2
N$37
  Top 0.254: JP1.35 69.55,15.45 68.5,16.5 68.5,27 64.92,30.58 U1.P78
N$38  (via drill 0.6)
  Top 0.2: U1.P71 59,26.13 59,29 57,29 57,33 v56.5,33
  Bottom 0.2: v56.5,33 56,33 56,33.13 IC1.10
N$39  (via drill 0.6)  (1 unrouted)
  Top 0.2: v59,49 59,47.5
  Bottom 0.2: R2.1 61,41.58 61,49 v59,49
N$40  (via drill 0.6)  (1 unrouted)
  Top 0.2: v50,43.5 v50,46 | v42.5,49 42.5,47.5
  Bottom 0.2: IC1.7 51.5,35.08 51.5,43.5 v50,43.5 | v50,46 50,46.5 42.5,46.5 v42.5,49
N$41
  Top 0.254: U1.P79 65.42,31.08 69,27.5 69,17 69.5,16.5 80.22,16.5 JP1.36
N$42  (via drill 0.6)  (2 unrouted)
  Top 0.2: 42,47.5 v42,44.25
  Bottom 0.2: R1.1 42,41.75 | 42,41.5 41.75,41.75 41.75,44 v42,44.25
N$43  (via drill 0.6)
  Top 0.2: v59.76,46 58.48,46 U1.P111
  Bottom 0.2: R3.1 60,43.68 60,46 v59.76,46
N$44
  Top 0.254: U1.P80 65.92,31.58 69.5,28 69.5,18.5 70,18 JP1.33
N$45  (1 unrouted)
  Top 0.254: U1.P82 65.92,32.58 70,28.5 70,20 70.5,19.25 80,19.25 81.5,18
N$46
  Top 0.254: U1.P83 66.42,33.08 70.5,29 70.5,21.5 71.5,20.5 78.7,20.5 JP1.31
N$47
  Top 0.254: U1.P84 66.92,33.58 71,29.5 71,23 72,22 80.3,22 JP1.32
N$48
  Top 0.254: U1.P85 67.42,34.08 71.5,30 71.5,24 72.5,23 78.66,23 JP1.29
N$49
  Top 0.254: U1.P86 67.92,34.58 72,30.5 72,25 72.5,24.5 79.84,24.5 JP1.30
N$50
  Top 0.254: U1.P87 68.42,35.08 72.5,31 72.5,26 73,25.5 78.62,25.5 JP1.27
N$51
  Top 0.254: U1.P89 68.42,36.08 73,31.5 73,27 80.38,27 JP1.28
N$52
  Top 0.254: U1.P90 68.92,36.58 73.5,32 73.5,28.5 74,28 78.58,28 JP1.25
N$53  (2 unrouted)
N$54  (3 unrouted)
N$55  (2 unrouted)
N$56  (3 unrouted)
N$57  (2 unrouted)
N$58  (3 unrouted)
N$59  (2 unrouted)
N$60  (3 unrouted)
N$61  (2 unrouted)
N$62  (1 unrouted)
N$63  (1 unrouted)
N$64  (1 unrouted)
N$65  (1 unrouted)
N$66  (1 unrouted)
PROM_DO  (via drill 0.6)
  Top 0.2: U1.P65 56,26.13 56,28 55,28 55,32.5 53,32.5 53,39 v56.5,39
  Bottom 0.2: v56.5,39 54.67,39 IC1.1
PROM_INITB  (via drill 0.6)  (1 unrouted)
  Top 0.2: U1.P58 52.5,26.13 v52.5,28
  Bottom 0.2: v52.5,28 52,28 52,34.5 54.5,34.5
PS2CLK  (1 unrouted)
PS2DAT  (1 unrouted)
RED
  Bottom 0.406: X2.15 15.45,40.12 16.06,40.74 17.16,40.74 JP2.5
SCART_BLUE  (3 unrouted)
SCART_COMP  (2 unrouted)
SCART_GREEN  (3 unrouted)
SCART_RED  (3 unrouted)
TCK
  Bottom 0.2: R2.2 57.5,41.58 57.5,35.73 IC1.6
TMS
  Bottom 0.2: R3.2 57,43.68 57,41.5 52,41.5 52,36.5 54.67,36.5 IC1.5
VCC  (via drill 0.6)  (5 unrouted)
  Top 0.2: U1.P75 60,29.08 60,31 58.55,31 | 41.58,29.08 41.5,29 | U1.P3 40.92,44.58 41.25,44.5 41.25,43 42.95,43 | 56.5,26.13 56.5,28.5 v56,29 | U$1.P8 33.54,26.04 33.5,26
  Top 0.254: 42.95,36.58 40.1,36.58 U1.P19 | U1.P34 42.95,29.08 | U1.P106 58.55,44.58 58.55,43 | U1.P91 58.55,37.08 | 56.48,27.48 U1.P66 56.5,26.13 | U1.P43 45,26.16 45,30 | U1.P138 44.98,43.02 45,43 | U1.P115 56.48,43.02 56.5,43 | U1.P126 51,47.53 51,42 | U1.P54 50.5,26.13 50.5,29 | U$1.P8 33.5,27.08
  Top 0.6: 42.95,43 42.95,36.58 42.95,33.5 | 42.95,30 42.95,29.08 41.58,29.08 | 42.95,30 42.95,33.5 | 43.03,43 45,43 v46,43 | v48.75,42.5 48.75,42 51,42 52.5,42 v52.5,42.5 | v55,43 56.5,43 58.55,43 58.55,37.08 58.55,31 58.5,31 v58.5,30.5 | 42.95,30 45,30 v46,30 | v49,30 49,29 50.5,29 53,29 v53,30 | v32.5,26 33.5,26 40,26 41.5,27.5 41.5,29 | v42,33.5 42.95,33.5
  Bottom 0.2: IC1.18 IC1.19 IC1.20 48,38.98 | 48,42.25 48.25,42.25 | 48.5,42.5 v48.75,42.5 | v56,29 56,30
  Bottom 0.4: 48,38.98 48,42.25
  Bottom 0.6: 48,42.25 48,43 v46,43 | v52.5,42.5 55,42.5 v55,43 | v49,30 v46,30 | 48.25,42.25 48.5,42.5 | v58.5,30.5 58.5,30 56,30 v53,30 | U$3.3 31.19,39.19 29.5,37.5 29.5,33 | 29.5,33 30,32.5 36,32.5 | 36,32.5 37,32.5 38,33.5 v42,33.5 | U$4.3 35.81,32.69 36,32.5 | v32.5,26 29.5,26 29.5,33
VCC_5V  (2 unrouted)
VCC_B2  (5 unrouted)
VCCAUX  (via drill 0.6)  (1 unrouted)
  Top 0.254: U1.P120 54,47.53 54,46 | 47,39.5 47,47.5 | U1.P62 54.5,26.13 54.5,32 | 47.48,32 U1.P48
  Top 0.4: 52.5,39.5 47,39.5 | 52.5,32 47.48,32 | 54.5,32 52.5,32 | 52.5,32 52.5,39.5 | 52.5,39.5 54,39.5 54,46 v54.5,46
  Bottom 0.4: U$3.4 36.5,45.6 36.5,46 49,46 49,45 52.5,45 52.5,45.5 54.5,45.5 v54.5,46
VCCINT  (via drill 0.6)  (1 unrouted)
  Top 0.2: 48,28 48,26
  Top 0.254: U1.P61 54,26.13 54,31 | U1.P133 47.48,40.52 47.5,40.5 | U1.P121 53.5,47.51 53.5,40.5 53,40.5 | v50.5,41 50.5,40.5
  Top 0.4: 50.5,31 47.98,31 47.98,28.02 48,28 v49.5,28 | 47.5,40.5 50.5,40.5 53,40.5 | 54,31 50.5,31 | 50.5,31 v50.5,30
  Bottom 0.4: v50.5,30 v50.5,41 | v49.5,28 48,27 38,27 36,29 35.4,29 U$4.4